# EAGLE design RPI_LoRa_v1.2 (EAGLE 8.7.0)
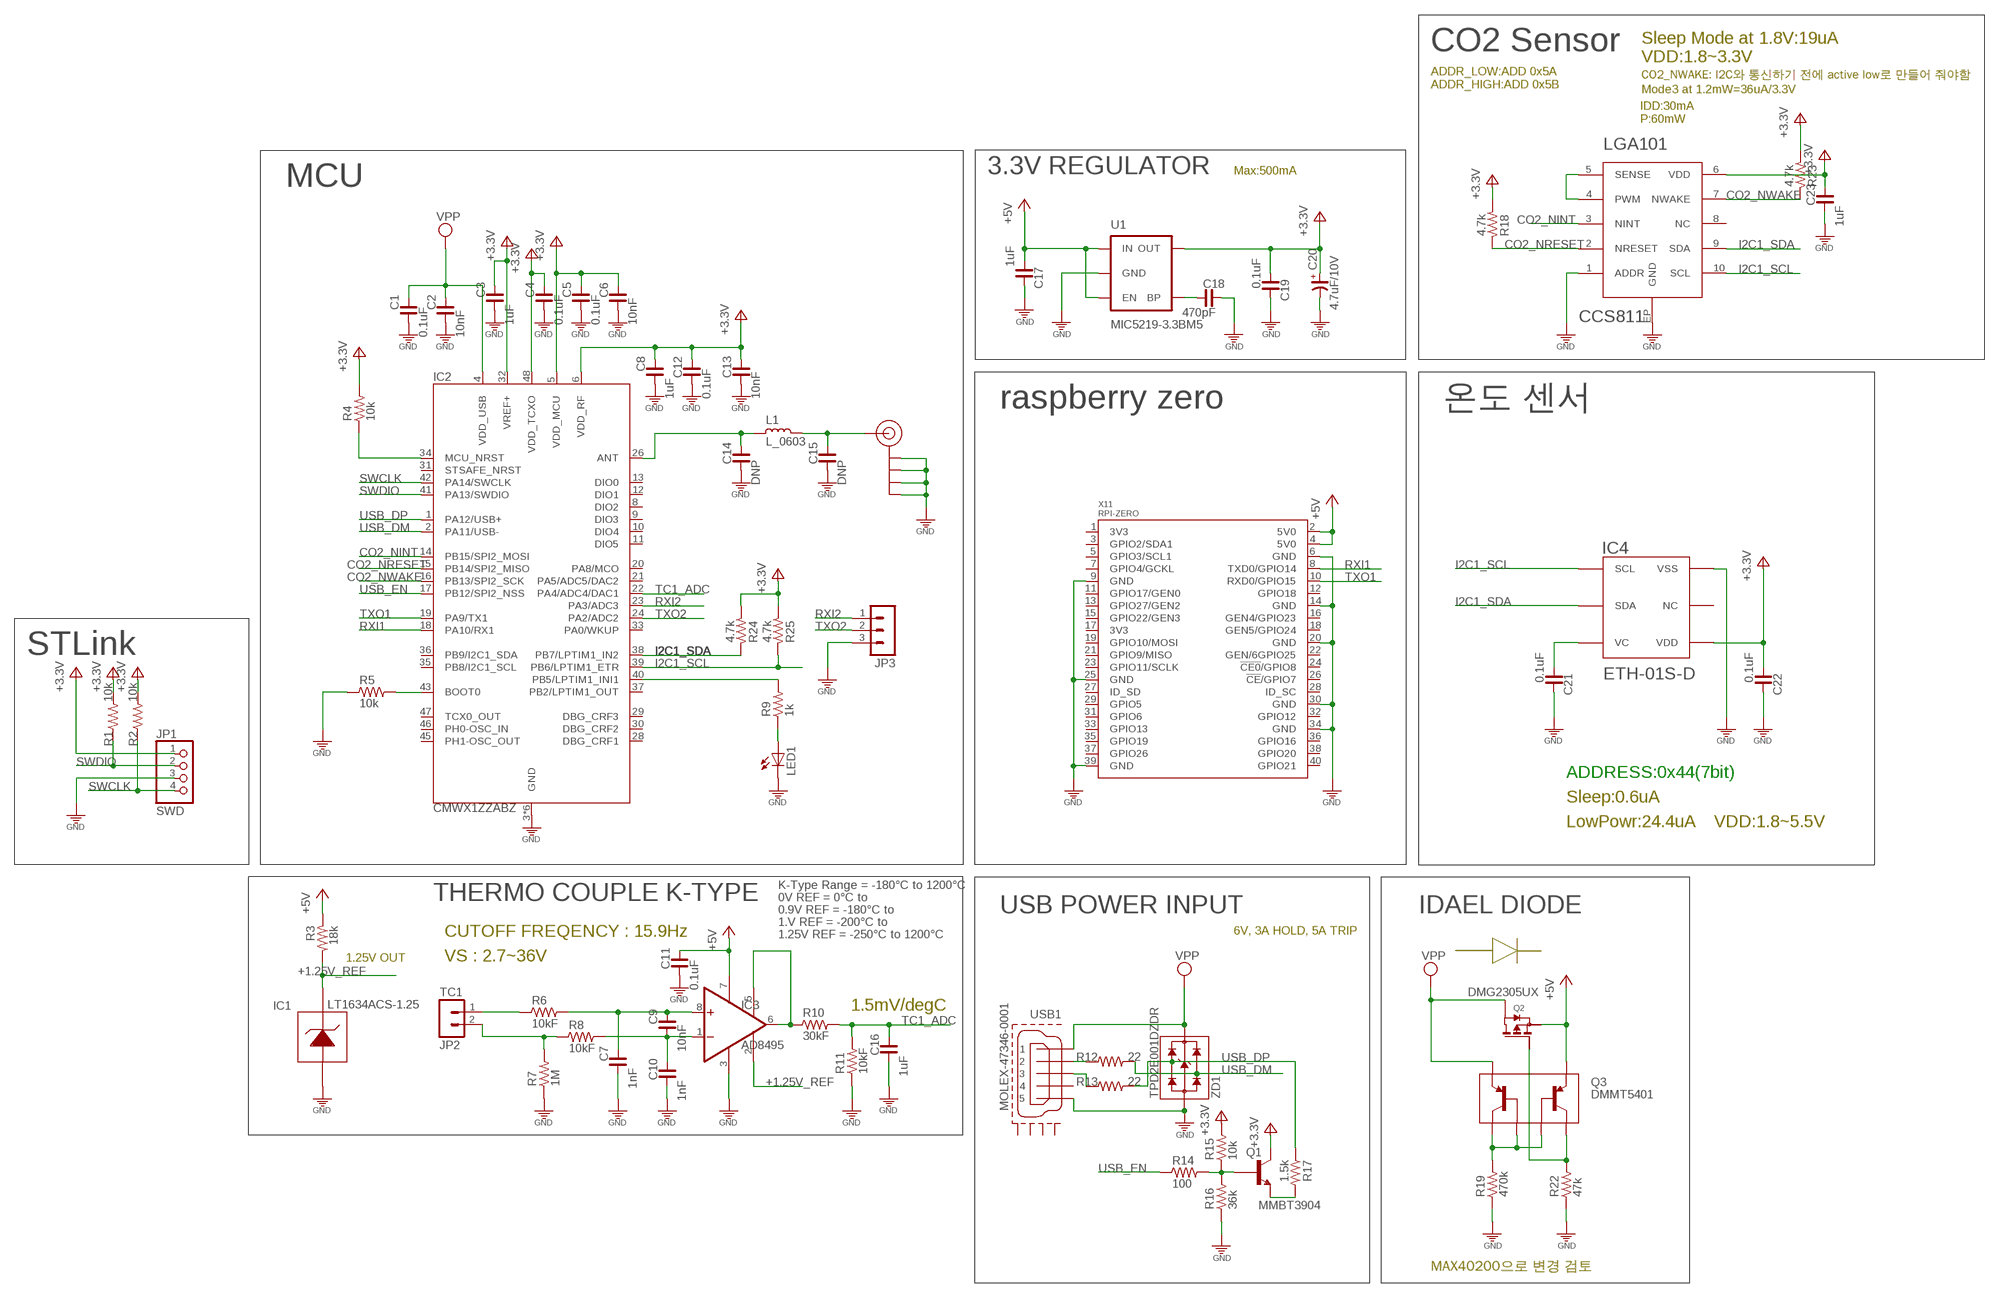
[diagram p0: schematic, sheet 1]

## Parts
C1  0.1uF  C_0603  [C0603]
C2  10nF  C_0603  [C0603]
C3  1uF  C_0603  [C0603]
C4  0.1uF  C_0603  [C0603]
C5  0.1uF  C_0603  [C0603]
C6  10nF  C_0603  [C0603]
C7  1nF  C_0603  [C0603]
C8  1uF  C_0603  [C0603]
C9  10nF  C_0603  [C0603]
C10  1nF  C_0603  [C0603]
C11  0.1uF  C_0603  [C0603]
C12  0.1uF  C_0603  [C0603]
C13  10nF  C_0603  [C0603]
C14  DNP  C_0603  [C0603]
C15  DNP  C_0603  [C0603]
C16  1uF  C_0603  [C0603]
C17  1uF  C_0603  [C0603]
C18  470pF  C_0603  [C0603]
C19  0.1uF  C_0603  [C0603]
C20  4.7uF/10V  CP_2012  [C2012/T]
C21  0.1uF  C_0603  [C0603]
C22  0.1uF  C_0603  [C0603]
C23  1uF  C_0603  [C0603]
IC1  LT1634ACS-1.25  LT1634MS8  [MS8]
IC2  CMWX1ZZABZ  [CMWX1ZZABZ]
IC3  AD8495  AD849X  [MSOP8]
IC4  ETH-01S-D  [SENSOR]
J$1  SMA_EDGE  [SMA-EDGE]
JP1  SWD  PINHD-1X4M  [1X04M]
JP2  TC1  MA02ED350V-02P  [ED350V-02P]
JP3  MA03-15267  [MOLEX5267-03]
L1  L_0603  [L0603]
LED1  LEDSMD-1608  [LED-1608]
LGA101  CCS811  [CCS811]
Q1  MMBT3904  [SOT23]
Q2  DMG2305UX  P-FET  [SOT23]
Q3  DMMT5401  [SOT23-6L]
R1  10k  R_0603  [R0603]
R2  10k  R_0603  [R0603]
R3  18k  R_0603  [R0603]
R4  10k  R_0603  [R0603]
R5  10k  R_0603  [R0603]
R6  10kF  R_0603  [R0603]
R7  1M  R_0603  [R0603]
R8  10kF  R_0603  [R0603]
R9  1k  R_0603  [R0603]
R10  30kF  R_0603  [R0603]
R11  10kF  R_0603  [R0603]
R12  22  R_0603  [R0603]
R13  22  R_0603  [R0603]
R14  100  R_0603  [R0603]
R15  10k  R_0603  [R0603]
R16  36k  R_0603  [R0603]
R17  1.5k  R_0603  [R0603]
R18  4.7k  R_0603  [R0603]
R19  470k  R_0603  [R0603]
R22  47k  R_0603  [R0603]
R23  4.7k  R_0603  [R0603]
R24  4.7k  R_0603  [R0603]
R25  4.7k  R_0603  [R0603]
U1  MIC5219-3.3BM5  V_REG_LDOSMD  [SOT23-5]
USB1  MOLEX-47346-0001  [MOLEX-47364-0001]
X11  RPI-ZERO  [RASP_PI_ZERO_BOARD_FULL]
ZD1  TPD2E001DZDR  TPD2E001DZD  [DZD]

## Nets
3V3: C3.1 C4.1 C5.1 C6.1 C8.1 C12.1 C13.1 C19.2 C20.+ C22.2 C23.1 IC2.5(VDD_MCU) IC2.6(VDD_RF) IC2.32(VREF+) IC2.48(VDD_TCXO) IC4.P$4(VDD) JP1.1 LGA101.6(VDD) Q1.D(OUT) R1.2 R2.2 R4.2 R15.2 R18.2 R23.2 R24.2 R25.2 U1.5(OUT) ; supply symbol labelled +3V3
+1.25V_REF: IC1.6(VOUT) IC3.2(REF) R3.2
+5V: C11.1 C17.2 IC3.7(V+) Q2.S(SOURCE) Q3.5(E2) R3.1 U1.1(IN) U1.3(EN) X11.2(5V0) X11.4(5V0)
ANTL: C15.1 J$1.SIG(SIGNAL) L1.1
CO2_NINT: IC2.14(PB15/SPI2_MOSI) LGA101.3(NINT)
CO2_NRESET: IC2.15(PB14/SPI2_MISO) LGA101.2(NRESET) R18.1
CO2_NWAKE: IC2.16(PB13/SPI2_SCK) LGA101.7(NWAKE) R23.1
GND: C1.2 C2.2 C3.2 C4.2 C5.2 C6.2 C7.2 C8.2 C10.2 C11.2 C12.2 C13.2 C14.2 C15.2 C16.2 C17.1 C18.1 C19.1 C20.- C21.1 C22.1 C23.2 IC1.4(GND) IC2.3(GND) IC2.7(GND) IC2.25(GND) IC2.27(GND) IC2.44(GND) IC2.PAD(GND) IC3.3(V-) IC4.P$6(VSS) J$1.GND@0(GND) J$1.GND@1(GND) J$1.GND@2(GND) J$1.GND@3(GND) JP1.3 JP3.3 LED1.C LGA101.1(ADDR) LGA101.EP(GND) R5.1 R7.1 R11.1 R16.1 R19.1 R22.1 U1.2(GND) USB1.5 X11.6(GND) X11.9(GND) X11.14(GND) X11.20(GND) X11.25(GND) X11.30(GND) X11.34(GND) X11.39(GND) ZD1.1(GND)
I2C1_SCL: IC2.39(PB6/LPTIM1_ETR) IC4.P$1(SCL) LGA101.10(SCL) R25.1
I2C1_SDA: IC2.38(PB7/LPTIM1_IN2) IC4.P$2(SDA) LGA101.9(SDA) R24.1
N$1: C18.2 U1.4(BP)
N$2: LGA101.4(PWM) LGA101.5(SENSE)
N$3: R13.1 USB1.3
N$4: R12.1 USB1.2
N$5: Q2.G(GATE) Q3.4(C2) R22.2
N$6: LED1.A R9.1
N$7: IC2.34(MCU_NRST) R4.1
N$8: IC2.40(PB5/LPTIM1_INI1) R9.2
N$9: Q3.1(C1) Q3.2(B1) Q3.3(B2) R19.2
N$13: C21.2 IC4.P$3(VC)
N$17: C14.1 IC2.26(ANT) L1.2
N$18: IC2.43(BOOT0) R5.2
N$39: Q1.G(IN) R14.2 R15.1 R16.2
N$41: C9.2 C10.1 IC3.1(-IN) R8.2
N$42: C7.1 C9.1 IC3.8(+IN) R6.2
N$45: JP2.2 R7.2 R8.1
N$46: JP2.1 R6.1
N$47: IC3.5(SENS) IC3.6(OUT) R10.1
N$81: Q1.S(GND) R17.2
RXI1: IC2.18(PA10/RX1) X11.8(TXD0/GPIO14)
RXI2: IC2.23(PA3/ADC3) JP3.1
SWCLK: IC2.42(PA14/SWCLK) JP1.4 R2.1
SWDIO: IC2.41(PA13/SWDIO) JP1.2 R1.1
TC1_ADC: C16.1 IC2.22(PA4/ADC4/DAC1) R10.2 R11.2
TXO1: IC2.19(PA9/TX1) X11.10(RXD0/GPIO15)
TXO2: IC2.24(PA2/ADC2) JP3.2
USB_DM: IC2.2(PA11/USB-) R12.2 ZD1.3(IO2)
USB_DP: IC2.1(PA12/USB+) R13.2 R17.1 ZD1.2(IO1)
USB_EN: IC2.17(PB12/SPI2_NSS) R14.1
VPP: C1.1 C2.1 IC2.4(VDD_USB) Q2.D(DRAIN) Q3.6(E1) USB1.1 ZD1.4(VCC)
Unconnected: IC2.8(DIO2) IC2.9(DIO3) IC2.10(DIO4) IC2.11(DIO5) IC2.12(DIO1) IC2.13(DIO0) IC2.20(PA8/MCO) IC2.21(PA5/ADC5/DAC2) IC2.28(DBG_CRF1) IC2.29(DBG_CRF3) IC2.30(DBG_CRF2) IC2.31(STSAFE_NRST) IC2.33(PA0/WKUP) IC2.35(PB8/I2C1_SCL) IC2.36(PB9/I2C1_SDA) IC2.37(PB2/LPTIM1_OUT) IC2.45(PH1-OSC_OUT) IC2.46(PH0-OSC_IN) IC2.47(TCX0_OUT) LGA101.8(NC) USB1.4 USB1.GND1 USB1.GND2 USB1.GND3 USB1.GND4 X11.1(3V3) X11.3(GPIO2/SDA1) X11.5(GPIO3/SCL1) X11.7(GPIO4/GCKL) X11.11(GPIO17/GEN0) X11.12(GPIO18) X11.13(GPIO27/GEN2) X11.15(GPIO22/GEN3) X11.16(GEN4/GPIO23) X11.17(3V3) X11.18(GEN5/GPIO24) X11.19(GPIO10/MOSI) X11.21(GPIO9/MISO) X11.22(GEN/6GPIO25) X11.23(GPIO11/SCLK) X11.24(!CE0!/GPIO8) X11.26(!CE!/GPIO7) X11.27(ID_SD) X11.28(ID_SC) X11.29(GPIO5) X11.31(GPIO6) X11.32(GPIO12) X11.33(GPIO13) X11.35(GPIO19) X11.36(GPIO16) X11.37(GPIO26) X11.38(GPIO20) X11.40(GPIO21)

## Notes on the sheet
- Sleep Mode at 1.8V:19uA
- CO2 Sensor
- VDD:1.8~3.3V
- CO2_NWAKE: I2C와 통신하기 전에 active low로 만들어 줘야함
- ADDR_LOW:ADD 0x5A
  ADDR_HIGH:ADD 0x5B
- Mode3 at 1.2mW=36uA/3.3V
- IDD:30mA
  P:60mW
- 3.3V REGULATOR | Max:500mA
- MCU
- raspberry zero | 온도 센서
- STLink
- ADDRESS:0x44(7bit)
- Sleep:0.6uA
- LowPowr:24.4uA | VDD:1.8~5.5V
- K-Type Range = -180°C to 1200°C
- THERMO COUPLE K-TYPE | 0V REF = 0°C to
- 0.9V REF = -180°C to | USB POWER INPUT | IDAEL DIODE
- 1.V REF = -200°C to | 6V, 3A HOLD, 5A TRIP
- CUTOFF FREQENCY : 15.9Hz | 1.25V REF = -250°C to 1200°C
- 1.25V OUT | VS : 2.7~36V
- 1.5mV/degC
- MAX40200으로 변경 검토

## Power pins joined to a net without a drawn wire
NC: IC4.P$5(NC)

## Library data of the parts
C1-C19 C21-C23 = cona_lib:C_: NON-POLARIZED CAP
C20 = cona_lib:CP_: POLARIZED CAP
IC1 = cona_lib:LT1634: Initial Voltage Accuracy: 0.05% n Low Operating Current: 10µA n Low Drift: 10ppm/°C Max n Less Than 1Ω Dynamic Impedance n Both Commercial and Industrial Temperature Range Parts Are Available n Available in 1.25V, 2.5V, 4.096V and 5V in SO-8 and TO-92 Packages n 1.25V and 2.5V Available in MSOP Package
IC2 = cona_lib:CMWX1ZZABZ
IC3 = cona_lib:AD849X
IC4 = ETH-01S-D:ETH-01S-D
J$1 = 3DRobotics:SMA_EDGE: SMA Antenna Connector End launch SMA connector. The paste layer has been removed so that the connector can be hand soldered onto the board after reflow.
JP1 = pinhead:PINHD-1X4: PIN HEADER
JP2 = cona_lib:MA02
JP3 = cona_lib:MA03-1: PIN HEADER
L1 = cona_lib:L_: INDUCTOR
LED1 = cona_lib:LED: LED OSRAM: - CHIPLED LG R971, LG N971, LY N971, LG Q971, LY Q971, LO R971, LY R971 LH N974, LH R974 LS Q976, LO Q976, LY Q976 LO Q996 - Hyper CHIPLED LW Q18S LB Q993, LB Q99A, LB R99A - SideLED LS A670, LO A670, LY A670, LG A670, LP A670 LB A673, LV A673, LT A673, LW A673 LH A674 LY A675 LS A676, LA A676, LO A676, LY A676, LW A676 LS A679, LY A679, LG A679 - Hyper Micro SIDELED® LS Y876, LA Y876, LO Y876, LY Y876 LT Y87S - SmartLED LW L88C, LW L88S LB L89C, LB L89S, LG L890 LS L89K, LO L89K, LY L89K LS L896, LA L896, LO L896, LY L896 - TOPLED LS T670, LO T670, LY T670, LG T670, LP T670 LSG T670, LSP T670, LSY T670, LOP T670, LYG T670 LG T671, LOG T671, LSG T671 LB T673, LV T673, LT T673, LW T673 LH T674 LS T676, LA T676, LO T676, LY T676, LB T676, LH T676, LSB T676, LW T676 LB T67C, LV T67C, LT T67C, LS T67K, LO T67K, LY T67K, LW E67C LS E67B, LA E67B, LO E67B, LY E67B, LB E67C, LV E67C, LT E67C LW T67C LS T679, LY T679, LG T679 LS T770, LO T770, LY T770, LG T770, LP T770 LB T773, LV T773, LT T773, LW T773 LH T774 LS E675, LA E675, LY E675, LS T675 LS T776, LA T776, LO T776, LY T776, LB T776 LHGB T686 LT T68C, LB T68C - Hyper Mini TOPLED® LB M676 - Mini TOPLED Santana® LG M470 LS M47K, LO M47K, LY M47K Source: http://www.osram.convergy.de LUXEON: - LUMILED® LXK2-PW12-R00, LXK2-PW12-S00, LXK2-PW14-U00, LXK2-PW14-V00 LXK2-PM12-R00, LXK2-PM12-S00, LXK2-PM14-U00 LXK2-PE12-Q00, LXK2-PE12-R00, LXK2-PE12-S00, LXK2-PE14-T00, LXK2-PE14-U00 LXK2-PB12-K00, LXK2-PB12-L00, LXK2-PB12-M00, LXK2-PB14-N00, LXK2-PB14-P00, LXK2-PB14-Q00 LXK2-PR12-L00, LXK2-PR12-M00, LXK2-PR14-Q00, LXK2-PR14-R00 LXK2-PD12-Q00, LXK2-PD12-R00, LXK2-PD12-S00 LXK2-PH12-R00, LXK2-PH12-S00 LXK2-PL12-P00, LXK2-PL12-Q00, LXK2-PL12-R00 Source: www.luxeon.com KINGBRIGHT: KA-3528ASYC Source: www.kingbright.com
LGA101 = kmh:CCS811
Q1 = cona_lib:MMBT3904
Q2 = cona_lib:P-FET
Q3 = cona_lib:DMMT5401
R1-R19 R22-R25 = cona_lib:R_: RESISTOR
U1 = SparkFun:V_REG_LDO: Voltage Regulator LDO Standard 150mA LDO voltage regulator in SOT-23 layout. Micrel part MIC5205. BP (by-pass) pin is used to lower output noise with 470pF cap.
USB1 = usb_con-update:MOLEX-47346-0001: MICRO USB B, BOTTOM MOUNT
X11 = rpi-zero:RPI-ZERO
ZD1 = cona_lib:TPD2E001

## Net classes
0 default: clearance 0.152 mm
2 GND: width 0.406 mm, clearance 0.152 mm

## Board
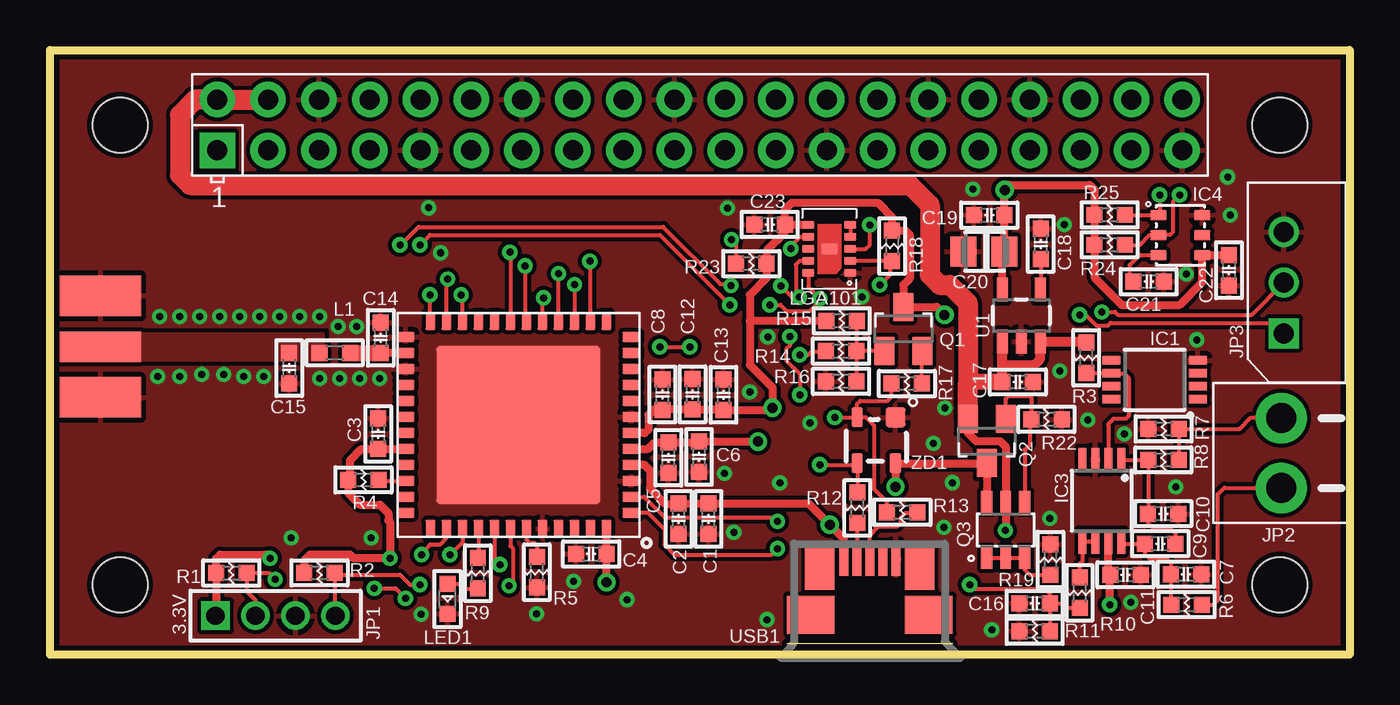
[diagram p1: board, top side]
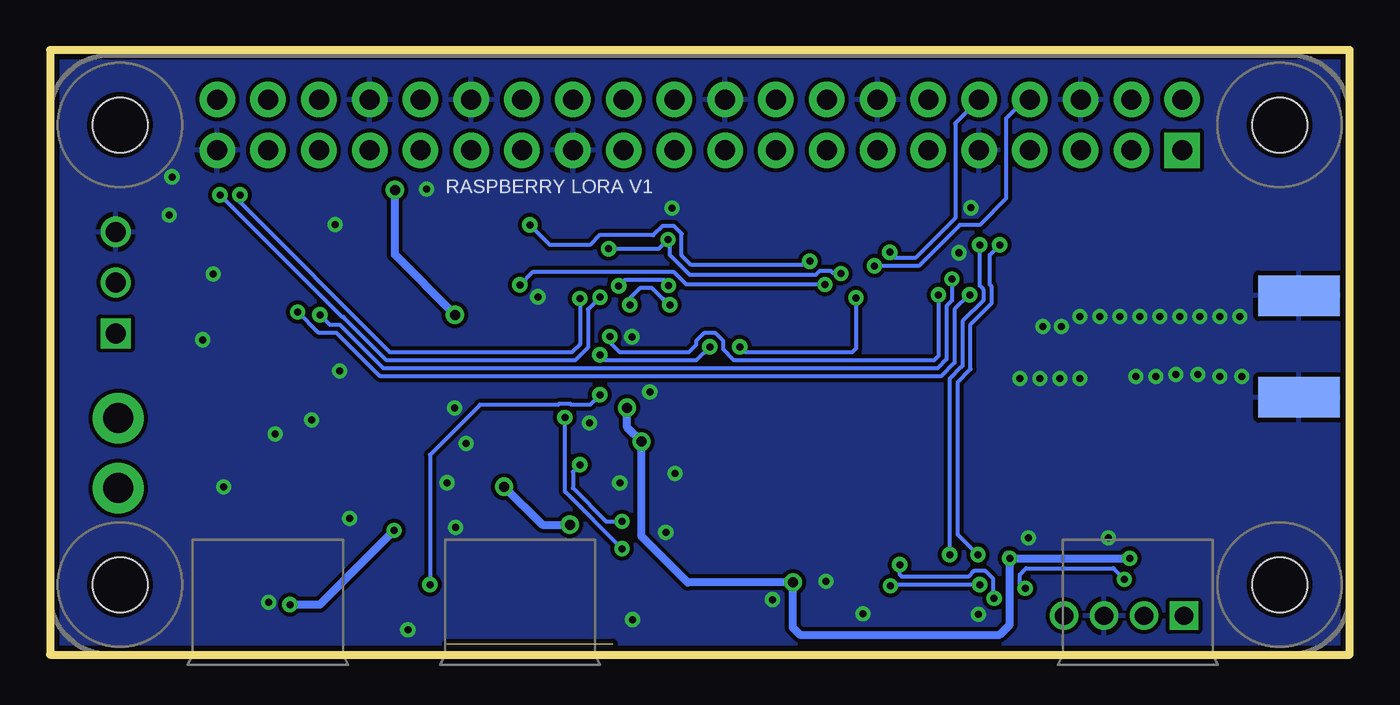
[diagram p2: board, bottom side, seen from below]

Size 65 x 30.25 mm. Coordinates in mm from the lower left corner, seen from the top.
Outline: 0,30.25 65,30.25 65,0 0,0 0,30.25
Copper layers (1*16): Top 0.035mm / dielectric 1.5mm / Bottom 0.035mm
Design rules "KHC_mm": minimum track width 0.2mm, minimum drill 0.3mm, track to track 0.2mm, track to pad 0.2mm, pad to pad 0.2mm, via to via 0.2mm, smd to smd 0.2mm, copper to edge 10mil, drill to drill 0.2mm, minimum pad ring 10mil, minimum via ring 8mil, stop-mask expansion 4mil, vias tented up to drill 0mil, thermal gap 10mil

### Footprints (pad centres in the part's own frame; a part is rotated, then mirrored left to right if it is on the bottom)
C0603 = smd 0.8 x 0.8: 1 -0.762,0; 2 0.762,0
C2012/T = smd 1.3 x 1.5: + 1.016,0; - -1.016,0
MS8 = smd 0.42 x 0.899: 1 -0.975,-2.166; 2 -0.325,-2.166; 3 0.325,-2.166; 4 0.975,-2.166; 5 0.975,2.166; 6 0.325,2.166; 7 -0.325,2.166; 8 -0.975,2.166
CMWX1ZZABZ = smd 0.9 x 0.5: 1 -5.65,4.4; 2 -5.65,3.6; 3 -5.65,2.8; 4 -5.65,2; 5 -5.65,1.2; 6 -5.65,0.4; 7 -5.65,-0.4; 8 -5.65,-1.2; 9 -5.65,-2; 10 -5.65,-2.8; 11 -5.65,-3.6; 12 -5.65,-4.4; 25 5.65,-4.4; 26 5.65,-3.6; 27 5.65,-2.8; 28 5.65,-2; 29 5.65,-1.2; 30 5.65,-0.4; 31 5.65,0.4; 32 5.65,1.2; 33 5.65,2; 34 5.65,2.8; 35 5.65,3.6; 36 5.65,4.4 | smd 0.5 x 0.9: 13 -4.4,-5.2; 14 -3.6,-5.2; 15 -2.8,-5.2; 16 -2,-5.2; 17 -1.2,-5.2; 18 -0.4,-5.2; 19 0.4,-5.2; 20 1.2,-5.2; 21 2,-5.2; 22 2.8,-5.2; 23 3.6,-5.2; 24 4.4,-5.2; 37 4.4,5.2; 38 3.6,5.2; 39 2.8,5.2; 40 2,5.2; 41 1.2,5.2; 42 0.4,5.2; 43 -0.4,5.2; 44 -1.2,5.2; 45 -2,5.2; 46 -2.8,5.2; 47 -3.6,5.2; 48 -4.4,5.2 | smd 8.2 x 7.9: PAD 0,0
MSOP8 = smd 0.4 x 1.2: 1 -0.975,-2.05; 2 -0.325,-2.05; 3 0.325,-2.05; 4 0.975,-2.05; 5 0.975,2.05; 6 0.325,2.05; 7 -0.325,2.05; 8 -0.975,2.05
SENSOR = smd 0.82 x 0.5: P$1 -1.095,1; P$2 -1.095,0; P$3 -1.095,-1; P$4 1.095,-1; P$5 1.095,0; P$6 1.095,1
SMA-EDGE = smd 2.032 x 4.064: GND@0 -2.54,0; GND@1 2.54,0 | smd 2.032 x 4.064 bottom: GND@2 -2.54,0; GND@3 2.54,0 | smd 1.524 x 4.064: SIG 0,0
1X04M = drill 0.914 square: 1 -3,0 | drill 0.914: 2 -1,0; 3 1,0; 4 3,0
ED350V-02P = drill 1.5 pad 2.54: 1 -1.75,0; 2 1.75,0
MOLEX5267-03 = drill 1 square: 1 -2.54,0 | drill 1: 2 0,0; 3 2.54,0
L0603 = smd 0.8 x 0.8: 1 -0.762,0; 2 0.762,0
LED-1608 = smd 0.8 x 0.8: A -0.75,0; C 0.75,0
CCS811 = smd 0.6 x 0.4: 1 -1.05,1.2; 2 -1.05,0.6; 3 -1.05,0; 4 -1.05,-0.6; 5 -1.05,-1.2; 6 1.05,-1.2; 7 1.05,-0.6; 8 1.05,0; 9 1.05,0.6; 10 1.05,1.2 | smd 0.8 x 0.5: EP 0,0
SOT23 = smd 1 x 1.4: D 0,-1.1; G 0.95,1.1; S -0.95,1.1
SOT23-6L = smd 0.55 x 1.1: 1 -0.95,-1.4; 2 0,-1.4; 3 0.95,-1.4; 4 0.95,1.4; 5 0,1.4; 6 -0.95,1.4
R0603 = smd 0.8 x 0.8: 1 -0.762,0; 2 0.762,0
SOT23-5 = smd 0.55 x 1.2: 1 -0.95,-1.3; 2 0,-1.3; 3 0.95,-1.3; 4 0.95,1.3; 5 -0.95,1.3
MOLEX-47364-0001 = smd 1.7 x 0.45: 1 2.8,1.3; 2 2.8,0.65; 3 2.8,0; 4 2.8,-0.65; 5 2.8,-1.3 | smd 1.9 x 2.375: GND1 0,2.95; GND4 0,-2.95 | smd 2.1 x 1.475: GND2 2.3,2.5; GND3 2.3,-2.5
RASP_PI_ZERO_BOARD_FULL = drill 1 pad 1.778 square: 1 8.37,25.23 | drill 1 pad 1.778: 2 8.37,27.77; 3 10.91,25.23; 4 10.91,27.77; 5 13.45,25.23; 6 13.45,27.77; 7 15.99,25.23; 8 15.99,27.77; 9 18.53,25.23; 10 18.53,27.77; 11 21.07,25.23; 12 21.07,27.77; 13 23.61,25.23; 14 23.61,27.77; 15 26.15,25.23; 16 26.15,27.77; 17 28.69,25.23; 18 28.69,27.77; 19 31.23,25.23; 20 31.23,27.77; 21 33.77,25.23; 22 33.77,27.77; 23 36.31,25.23; 24 36.31,27.77; 25 38.85,25.23; 26 38.85,27.77; 27 41.39,25.23; 28 41.39,27.77; 29 43.93,25.23; 30 43.93,27.77; 31 46.47,25.23; 32 46.47,27.77; 33 49.01,25.23; 34 49.01,27.77; 35 51.55,25.23; 36 51.55,27.77; 37 54.09,25.23; 38 54.09,27.77; 39 56.63,25.23; 40 56.63,27.77 | hole 2.75: 3.5,3.5; 3.5,26.5; 61.5,3.5; 61.5,26.5
DZD = smd 1 x 1: 1 -0.96,-1.15 | smd 0.55 x 1: 2 0.96,-1.15; 3 0.96,1.15; 4 -0.96,1.15

### Placement (x,y rotation side)
C1  32.93,6.79 270 top
C2  31.44,6.79 270 top
C3  16.42,11.04 90 top
C4  27.07,5.03 180 top
C5  30.93,9.85 270 top
C6  32.46,9.89 270 top
C7  56.82,4.02 0 top
C8  30.63,13.01 90 top
C9  55.53,5.55 0 top
C10  55.68,7.05 0 top
C11  53.79,3.99 0 top
C12  32.14,13.02 90 top
C13  33.69,13 90 top
C14  16.54,15.85 90 top
C15  11.97,14.33 270 top
C16  49.25,2.56 180 top
C17  48.41,13.64 180 top
C18  49.55,20.54 270 top
C19  46.98,21.98 0 top
C20  46.71,20.17 0 top
C21  54.95,18.66 180 top
C22  58.97,19.23 90 top
C23  36,21.52 180 top
IC1  55.25,13.75 90 top
IC2  23.43,11.49 180 top
IC3  52.6,7.7 180 top
IC4  56.54,20.98 0 top
J$1  2.53,15.41 90 top
JP1  11.28,1.94 0 top
JP2  61.59,10.08 90 top
JP3  61.71,18.61 90 top
L1  14.24,15.1 0 top
LED1  19.88,2.78 270 top
LGA101  38.98,20.29 180 top
Q1  42.68,16.29 180 top
Q2  46.85,10.68 0 top
Q3  47.8,6.23 0 top
R1  9.07,4.08 180 top
R2  13.48,4.09 180 top
R3  51.83,14.85 270 top
R4  15.68,8.74 180 top
R5  24.35,4.12 90 top
R6  56.85,2.5 180 top
R7  55.7,11.29 0 top
R8  55.69,9.74 180 top
R9  21.4,4.07 90 top
R10  51.5,3.09 270 top
R11  49.25,1.17 0 top
R12  40.38,7.34 90 top
R13  42.63,7.12 180 top
R14  39.57,15.18 0 top
R15  39.6,16.7 180 top
R16  39.57,13.67 0 top
R17  42.86,13.56 0 top
R18  42.12,20.44 90 top
R19  50.04,4.75 270 top
R22  49.84,11.77 180 top
R23  35.08,19.56 0 top
R24  53,20.5 180 top
R25  53,22 180 top
U1  48.58,16.96 0 top
USB1  41,2 90 top
X11  0,0 0 top
ZD1  41.33,10.72 180 top

### Tracks (layer width: path | path; a pad name or v marks a point on that pad's centre or on a via)
3V3  (via drill 0.35, 0.5)
  Top 0.4: U1.5 47.63,20.07 | C20.+ 47.73,21.96 | C19.2 v47.74,23.24 v47.75,23.25 48,23.5 52,23.5 52.24,23.26 R25.2 R24.2 52.24,18.87 53.61,17.5 56.5,17.5 57.63,18.64 IC4.P$4 58.96,19.98 C22.2 | v44.75,17 44.36,17.39 Q1.D 42.68,18.5 43,18.82 43,21 42.8,21.2 R18.2 42.12,21.88 41.4,22.6 37.1,22.6 36.76,22.26 C23.1 | LGA101.6 36.79,21.49 C23.1 | IC2.6 29.76,11.08 29.93,11.25 29.93,12 30.18,12.25 C8.1 C12.1 32.16,12.24 C13.1 36.01,12.24 v36.13,12.35 | IC2.5 29.92,10.29 30.24,10.61 C5.1 32.42,10.61 C6.1 v35.41,10.65 | v36.13,12.35 | v27.84,3.61 C4.1 IC2.48 | v36.12,12.36 v36.13,12.35 | R2.2 12.72,4.72 13,5 15,5 15.18,4.82 v17,4.82 17,6.63 16.93,6.7 16.93,7.07 16.5,7.5 15.5,7.5 14.92,8.08 R4.2 15,8.82 15,9.71 15.57,10.28 C3.1 16.43,10.29 IC2.32 | JP1.1 8.31,1.97 R1.2 8.31,4.81 8.5,5 10.82,5 v11,4.82 | C23.1 36.76,21.12 35.84,20.2 R23.2 35.84,18.84 35,18 35,16.7 | 35,16.7 35,14.5 36.13,13.37 v36.13,12.35 | R15.2 35,16.7
  Top 0.5: 47.63,20.07 C20.+ | 47.73,21.96 C19.2
  Bottom 0.4: v44.75,17 47.75,20 v47.75,23.25 | v36.13,12.35 36.13,11.37 v35.41,10.65 35.41,5.91 33.11,3.61 v27.84,3.61 27.84,1.34 27.5,1 17.5,1 17,1.5 v17,4.82 | 17.12,5 17,4.88 v17,4.82 | v17,4.82 v11,4.82
+1.25V_REF
  Top 0.2: R3.2 53.07,14.09 IC1.6 53.73,14.07 53.95,13.85 53.95,11.94 53.81,11.8 53.19,11.8 52.92,11.54 IC3.2
+5V  (via drill 0.35)
  Top 0.2: Q2.S 46,11.68
  Top 0.4: Q2.S 45.9,11.1 46.32,10.68 47.52,10.68 47.8,10.4 Q3.5 v47.8,6.23 v47.79,6.22 | v53,2.5 53,3.96 C11.1 52.92,4.09 IC3.7
  Top 0.5: 47.65,14.5 C17.2 47.5,13.49 | 47.65,14.5 47.65,15.64 U1.1 | 47.65,14.5 49.24,14.5 49.53,14.79 U1.3 50.5,15.66 51.78,15.66 R3.1
  Top 0.8: C17.2 46.04,13.64 45.9,13.5
  Top 1: X11.4 X11.2 7.27,27.77 6.5,27 6.5,24 7,23.5 43,23.5 44,22.5 44,19 44.5,18.5 45,18.5 45.9,17.6 45.9,13.5 Q2.S
  Bottom 0.4: v47.79,6.22 51.51,2.5 v53,2.5
ANTL
  pour Top (no thermals): 4.07,16.07 13.63,16.05 13.65,14.74 4.05,14.74
CO2_NINT  (via drill 0.35)
  Top 0.2: 26.99,16.73 IC2.14 27.03,19.65 v27,19.68 | LGA101.3 40.79,20.29 41,20.5 v41,21.5
  Bottom 0.2: v27,19.68 27.18,19.5 32.93,19.5 33.4,19.97 33.4,21.05 33.8,21.45 34.36,21.45 34.83,20.98 37.52,20.98 38,20.5 40,20.5 v41,21.5
CO2_NRESET  (via drill 0.35)
  Top 0.2: LGA101.2 40.04,19.68 R18.1 42,19.56 42,19 v41.5,18.5 | v26.23,18.52 IC2.15
  Bottom 0.2: v26.23,18.52 33.16,18.52 33.78,19.14 40.87,19.14 v41.5,18.5
CO2_NWAKE  (via drill 0.35)
  Top 0.2: LGA101.7 37.5,20.89 | 37.5,20.89 37.49,20.89 | 37.5,20.89 37.05,20.44 v37.05,20.3 | v34.08,20.77 34.32,20.53 R23.1 | IC2.16 v25.43,19.07
  Bottom 0.2: v37.05,20.3 34.55,20.3 v34.08,20.77 34,20.69 34,20 33,19 26.71,19 26.51,19.2 25.95,19.2 25.82,19.07 v25.43,19.07
GND  (via drill 0.35)
  other vias: 33.73,9.06 35,13.13 34.2,6.11 56.83,19.04 50.02,6.81 33.88,22.34 18.93,22.35 45.14,8.6 51.91,11.74 44.18,10.57 38.01,11.59 36.5,8.59 26.18,3.67 24.34,2.03 18.57,2.01 16.06,5.83 16.48,13.81 15.48,13.81 14.48,13.81 13.48,13.81 10.68,13.91 9.68,13.91 8.68,14.01 7.58,14.01 6.48,13.91 5.38,13.91 5.48,16.91 6.48,16.91 7.48,16.91 8.48,16.91 9.48,16.91 10.48,16.91 11.48,16.91 12.48,16.91 13.48,16.91 14.41,16.42 15.34,16.41 12.06,5.83 56.32,8.39 54.06,2.61 47.1,1.23 50.51,14.18 44.76,12.34 50.74,21.52 59.03,21.99 46.17,23.28 40.6,17.9 35.9,15.9 58.9,23.9 57.37,15.75 28.87,2.75 35.87,1.75 44.72,6.37 53.73,11.03 19.53,20.1
  pour Top (rank 3): 0,30.25 65,30.25 65,0 0,0
  pour Bottom: 0,30.25 65,30.25 65,-0.25 0,-0.25
I2C1_SCL  (via drill 0.35)
  Top 0.2: R25.1 55.42,22 IC4.P$1 55.5,22.04 v55.5,23 | IC2.39 20.63,5.61 20.02,5 v20,5 | v36,17.5 36.54,17.5 36.84,17.2 38,17.2 38.5,17.7 v38.5,17.82 37.93,18.39 LGA101.10 38,19.02 | v18.5,20.5 19,21 30.5,21 v34,17.5
  Bottom 0.2: v18.5,20.5 18.5,18.46 18.32,18.28 18.32,17.72 19.36,16.68 19.36,14.45 19.4,14.4 20,13.8 v20,5 | v55.5,23 55.5,22.63 47.99,15.12 38.9,15.12 38.5,15.53 v38.5,17.82 | v34,17.5 34.28,17.78 34.34,17.78 34.9,18.34 35.5,18.34 36,17.84 v36,17.5
I2C1_SDA  (via drill 0.35)
  Top 0.2: R24.1 54.5,20.5 54.98,20.98 IC4.P$2 55.47,21 56.02,21 56.17,21.15 56.17,22.67 v56.5,23 | LGA101.9 37.49,19.69 37.31,19.51 37.31,18.05 37.43,17.93 | 37.43,17.93 v37.48,17.88 | IC2.38 19.83,5.83 19.5,5.5 19,5.5 18.58,5.08 v18.58,5 | v34.06,18.46 33.98,18.53 33.53,18.53 30.67,21.4 18.44,21.4 17.54,20.5 v17.5,20.5 | v36.55,18.45 37.07,17.93 37.43,17.93
  Bottom 0.2: v56.5,23 50.4,16.9 50.33,16.9 48.16,14.72 38.74,14.72 38.1,15.36 38.1,17.26 v37.48,17.88 | v18.58,5 19.58,6 19.6,6 19.6,13.64 18.96,14.28 18.96,16.52 18.2,17.27 17.92,17.55 17.92,18.45 18,18.52 18,20 v17.5,20.5 | v34.06,18.46 34.06,18.56 34.23,18.73 36.27,18.73 v36.55,18.45
N$1
  Top 0.2: C18.2 49.55,18.28
  Top 0.5: 49.55,18.28 U1.4
N$2
  Top 0.2: LGA101.5 LGA101.4
N$3
  Top 0.2: USB1.3 41,5.97 41.45,6.42 41.5,6.42 42.39,6.42 42.57,6.6 42.57,6.87 42.78,7.08 43.35,7.08 R13.1
N$4
  Top 0.2: USB1.2 40.38,4.83 R12.1
N$5
  Top 0.2: Q2.G 47.8,12.8 47.94,12.94 49,12.94 49.08,12.86 R22.2 49,11.69 49,10.48 48.76,10.24 Q3.4
N$6
  Top 0.2: LED1.A 20.45,3.53 20.68,3.3 R9.1
N$7
  Top 0.2: R4.1 16.49,8.69 IC2.34
N$8
  Top 0.2: IC2.40 21.43,4.86 R9.2
N$9
  Top 0.2: Q3.1 Q3.2 Q3.3 48.75,4.25 49.01,3.99 R19.2
N$13
  Top 0.2: C21.2 54,18.85 54,19.5 54.5,20 55.42,20 IC4.P$3
N$17
  Top 0.4: IC2.26 C14.1
  Top 0.8: L1.2 15.01,15.09 C14.1
N$18
  Top 0.2: IC2.43 23.83,5.74 23.99,5.58 24.25,5.58 24.35,5.47 R5.2
N$39
  Top 0.2: Q1.G 40.34,15.19 R14.2 | R14.2 R16.2 | R14.2 40.36,15.21 R15.1
N$41
  Top 0.2: IC3.1 R8.2 C10.1 54.92,6.58 55.15,6.35 56,6.35 56.29,6.06 C9.2
N$42
  Top 0.2: IC3.8 53.67,5.55 C9.1 54.77,5.03 55.03,4.77 55.84,4.77 55.85,4.78 56.06,4.57 C7.1 56.06,2.53 R6.2
N$45
  Top 0.2: R8.1 56.46,9.75 R7.2 59.5,11.29 60.07,11.86 61.56,11.86 JP2.2
N$46
  Top 0.2: R6.1 58.2,2.5 58.41,2.71 58.41,8.02 58.74,8.35 61.57,8.35 JP2.1
N$47
  Top 0.2: IC3.6 IC3.5 51.62,4.67 51.49,4.54 51.49,3.86 R10.1
N$81
  Top 0.2: R17.2 Q1.S
RXI1  (via drill 0.35)
  Top 0.2: v23.77,19.45 23.77,16.75 IC2.18
  Bottom 0.2: v23.77,19.45 21.55,19.45 19.5,21.5 18.5,21.5 17.18,22.82 17.18,23.32 17.18,26.82 16.23,27.77 X11.8
RXI2  (via drill 0.35)
  Top 0.2: IC2.23 19.83,18.73 v19.88,18.78 | v51.5,17 51.8,17 52.34,16.46 52.9,16.46 53.04,16.6 61.18,16.6 JP3.1
  Bottom 0.2: v51.5,17 51,16.5 50.5,16.5 48.32,14.32 20.61,14.32 20.16,14.78 20.16,17.44 19.88,17.72 v19.88,18.78
SWCLK  (via drill 0.35)
  Top 0.2: JP1.4 14.24,1.98 R2.1 14.33,4 17.5,4 18,3.5 v18.5,3.5 | IC2.42 23.03,5.43 23.18,5.28 23.18,3.67 v22.96,3.44
  Bottom 0.2: v18.5,3.5 22.9,3.5 v22.96,3.44
SWDIO  (via drill 0.35)
  Top 0.2: JP1.2 10.28,2.72 9.83,3.17 R1.1 10.95,4.08 v11.26,3.77 | v22.5,4.5 22.23,4.77 IC2.41 | v16.22,3.32 17.28,3.32 v17.78,2.82
  Bottom 0.2: v17.78,2.82 17.82,2.87 17.82,3.78 18.22,4.18 18.78,4.18 19.06,3.9 22.4,3.9 22.5,4 v22.5,4.5 | v11.26,3.77 11.81,4.32 16.18,4.32 16.5,4 16.5,3.5 16.32,3.32 v16.22,3.32
TC1_ADC  (via drill 0.35)
  Top 0.2: IC2.22 20.63,17.93 v20.56,18 | v46,3.5 46.2,3.3 49.5,3.3 49.52,3.29 49.77,3.29 50.01,3.05 C16.1 | v37,15.92 37,15.46 36.82,15.28 36.82,14.72 37.5,14.04 v37.5,13 | C16.1 50.54,2.56 50.77,2.33 R10.2 | C16.1 R11.2
  Bottom 0.2: v37.5,13 38,12.5 38.92,12.5 38.97,12.55 39.53,12.55 39.58,12.5 43.5,12.5 46,10 v46,3.5 | v20.56,18 20.56,14.94 20.78,14.72 30.78,14.72 31.32,15.26 31.32,15.68 31.72,16.08 32.28,16.08 32.68,15.68 32.68,15.5 33.06,15.12 36.5,15.12 37,15.62 v37,15.92
TXO1  (via drill 0.35)
  Top 0.2: v23,20.13 23.03,20.1 IC2.19
  Bottom 0.2: X11.10 19.72,26.58 19.72,21.85 21.72,19.85 22.72,19.85 v23,20.13
TXO2  (via drill 0.35)
  Top 0.2: IC2.24 19,16.72 v19,18 | v52.62,17.14 53.27,17.14 53.41,17 60.1,17 JP3.2
  Bottom 0.2: v52.62,17.14 52.6,17.14 51.56,16.1 50.67,16.1 48.53,13.97 48.49,13.92 20.45,13.92 19.76,14.61 19.76,17.27 19.03,18 v19,18
USB_DM  (via drill 0.35)
  Top 0.2: ZD1.3 | ZD1.3 R12.2 | IC2.2 29.72,7.89 30.76,6.85 36.21,6.85 v36.39,6.67 | v38.5,9.5 40.32,9.5 ZD1.3
  Bottom 0.2: v38.5,9.5 38.85,9.15 38.85,8.33 37.18,6.65 36.41,6.65 v36.39,6.67
USB_DP  (via drill 0.35)
  Top 0.2: R13.2 41.87,7.63 41.23,8.27 41.23,11.44 40.8,11.87 ZD1.2 | v39.25,11.87 ZD1.2 | ZD1.2 40.37,12.54 40.53,12.7 41.89,12.7 42.09,12.9 R17.1 | 29.17,7 IC2.1 29.91,7.09 30.73,6.27 30.73,5.5 31.23,5 36.09,5 v36.39,5.3
  Bottom 0.2: v36.39,5.3 39.25,8.16 v39.25,11.87
USB_EN  (via drill 0.35)
  Top 0.2: IC2.17 24.64,17.81 v24.68,17.85 | v30.5,15.4 v32,15.4 | v37.5,15 37.92,15 38.09,15.17 38.8,15.17 R14.1
  Bottom 0.2: v24.68,17.85 24.68,15.32 24.88,15.12 30.22,15.12 v30.5,15.4 | v32,15.4 32.68,14.72 37.22,14.72 v37.5,15
VPP  (via drill 0.5)
  Top 0.4: Q2.D 46.85,9.5 | 46.85,9.5 Q3.6 | 46.85,9.5 46.78,9.57 ZD1.4 v42.28,8.4 | USB1.1 39.7,5.8 v39,6.5 37.95,7.55 C1.1 C2.1 30.77,7.55 30.01,8.31 30.01,9.21 29.73,9.49 IC2.4
  Bottom 0.4: v42.28,8.4 40.37,6.5 v39,6.5

### Text on the board
_tPlace: 3.3V
_bPlace: RASPBERRY LORA V1